# EAGLE design breakout2 (EAGLE 4.15)
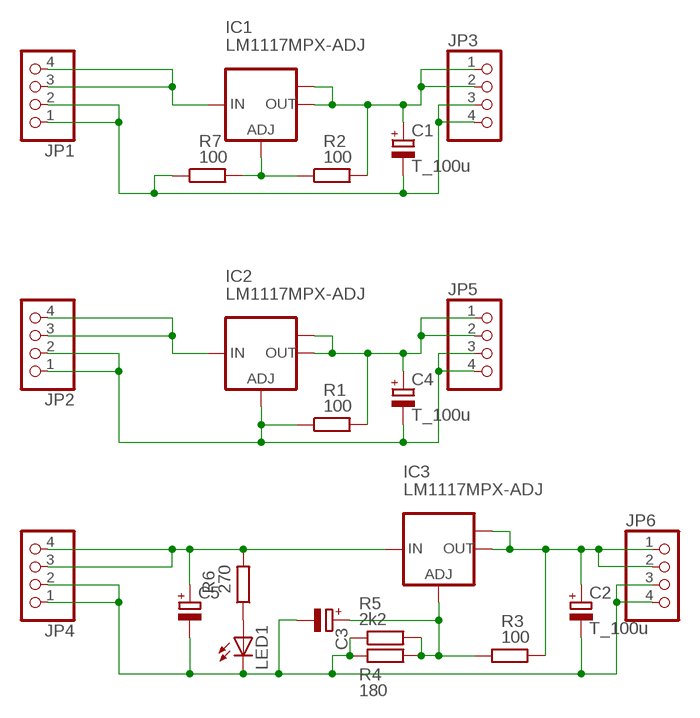
[diagram p0: schematic, sheet 1]

## Parts
C1  T_100u  CPOL-EUSMCC  [SMC_C]
C2  T_100u  CPOL-EUSMCC  [SMC_C]
C3  CPOL-EUB  [PANASONIC_B]
C4  T_100u  CPOL-EUSMCC  [SMC_C]
C5  CPOL-EUD  [PANASONIC_D]
IC1  LM1117MPX-ADJ  [SOT223]
IC2  LM1117MPX-ADJ  [SOT223]
IC3  LM1117MPX-ADJ  [SOT223]
JP1  PINHD-1X4  [1X04]
JP2  PINHD-1X4  [1X04]
JP3  PINHD-1X4  [1X04]
JP4  PINHD-1X4  [1X04]
JP5  PINHD-1X4  [1X04]
JP6  PINHD-1X4  [1X04]
LED1  LEDCHIPLED_0805  [CHIPLED_0805]
R1  100  R-EU_R0805  [R0805]
R2  100  R-EU_R0805  [R0805]
R3  100  R-EU_R0805  [R0805]
R4  180  R-EU_R0805  [R0805]
R5  2k2  R-EU_R0805  [R0805]
R6  270  R-EU_R0805  [R0805]
R7  100  R-EU_R0805  [R0805]

## Nets
FFFUUU: C4.+ IC2.2(OUT) IC2.TAB(OUT1) JP5.1 JP5.2 R1.2
FFFUUU1: C1.+ IC1.2(OUT) IC1.TAB(OUT1) JP3.1 JP3.2 R2.2
FFFUUU2: C2.+ IC3.2(OUT) IC3.TAB(OUT1) JP6.1 JP6.2 R3.2
N$1: C4.- IC2.1(ADJ) JP2.1 JP2.2 JP5.3 JP5.4 R1.1
N$2: IC2.3(IN) JP2.3 JP2.4
N$3: IC1.3(IN) JP1.3 JP1.4
N$4: C1.- JP1.1 JP1.2 JP3.3 JP3.4 R7.1
N$5: C5.+ IC3.3(IN) JP4.3 JP4.4 R6.2
N$6: IC1.1(ADJ) R2.1 R7.2
N$7: C2.- C3.- C5.- JP4.1 JP4.2 JP6.3 JP6.4 LED1.C R4.1 R5.1
N$8: C3.+ IC3.1(ADJ) R3.1 R4.2 R5.2
N$9: LED1.A R6.1

## Library data of the parts
C1-C5 = rcl:CPOL-EU: POLARIZED CAPACITOR, European symbol
IC1-IC3 = lm1117:LM1117MPX-ADJ
JP1-JP6 = pinhead:PINHD-1X4: PIN HEADER
LED1 = led:LED: LED OSRAM: - CHIPLED LG R971, LG N971, LY N971, LG Q971, LY Q971, LO R971, LY R971 LH N974, LH R974 LS Q976, LO Q976, LY Q976 LO Q996 - Hyper CHIPLED LW Q18S LB Q993, LB Q99A, LB R99A - SideLED LS A670, LO A670, LY A670, LG A670, LP A670 LB A673, LV A673, LT A673, LW A673 LH A674 LY A675 LS A676, LA A676, LO A676, LY A676, LW A676 LS A679, LY A679, LG A679 - Hyper Micro SIDELED® LS Y876, LA Y876, LO Y876, LY Y876 LT Y87S - SmartLED LW L88C, LW L88S LB L89C, LB L89S, LG L890 LS L89K, LO L89K, LY L89K LS L896, LA L896, LO L896, LY L896 - TOPLED LS T670, LO T670, LY T670, LG T670, LP T670 LSG T670, LSP T670, LSY T670, LOP T670, LYG T670 LG T671, LOG T671, LSG T671 LB T673, LV T673, LT T673, LW T673 LH T674 LS T676, LA T676, LO T676, LY T676, LB T676, LH T676, LSB T676, LW T676 LB T67C, LV T67C, LT T67C, LS T67K, LO T67K, LY T67K, LW E67C LS E67B, LA E67B, LO E67B, LY E67B, LB E67C, LV E67C, LT E67C LW T67C LS T679, LY T679, LG T679 LS T770, LO T770, LY T770, LG T770, LP T770 LB T773, LV T773, LT T773, LW T773 LH T774 LS E675, LA E675, LY E675, LS T675 LS T776, LA T776, LO T776, LY T776, LB T776 LHGB T686 LT T68C, LB T68C - Hyper Mini TOPLED® LB M676 - Mini TOPLED Santana® LG M470 LS M47K, LO M47K, LY M47K Source: http://www.osram.convergy.de/
R1-R7 = rcl:R-EU_: RESISTOR, European symbol

## Board
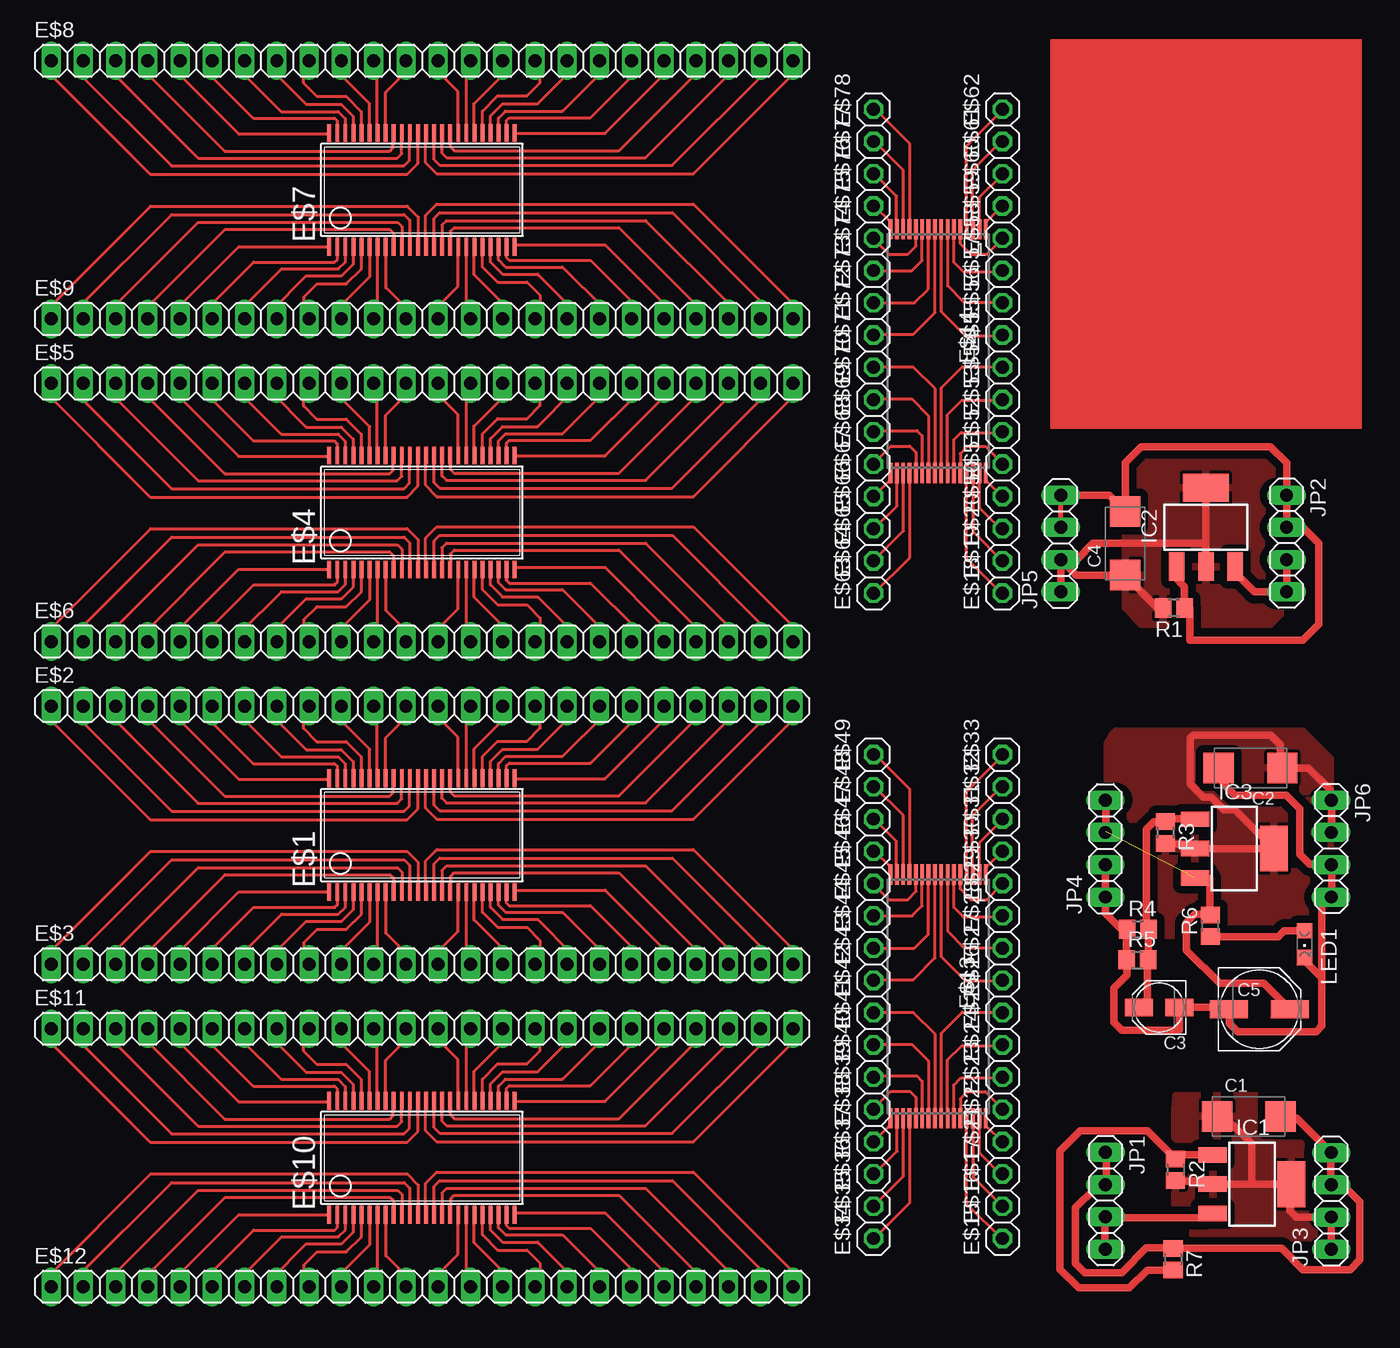
[diagram p1: board, top side]

No outline drawn. Coordinates in mm, seen from the top.
Copper layers (1*16): Top 0.035mm / dielectric 1.5mm / Bottom 0.035mm
Design rules "default": minimum track width 10mil, minimum drill 24mil, track to track 8mil, track to pad 8mil, pad to pad 8mil, via to via 8mil, smd to smd 8mil, copper to edge 40mil, drill to drill 8mil, minimum pad ring 10mil, minimum via ring 8mil, stop-mask expansion 4mil, vias tented up to drill 0mil, thermal gap 10mil

### Footprints (pad centres in the part's own frame; a part is rotated, then mirrored left to right if it is on the bottom)
SMC_C = smd 2.4 x 2.4: + -2.5,0; - 2.5,0
PANASONIC_B = smd 2.2 x 1.4: + 1.6,0; - -1.6,0
PANASONIC_D = smd 3 x 1.4: + 2.4,0; - -2.4,0
SSOP48DL = smd 0.305 x 1.397: 1 -7.303,-4.483; 2 -6.668,-4.483; 3 -6.032,-4.483; 4 -5.397,-4.483; 5 -4.763,-4.483; 6 -4.128,-4.483; 7 -3.493,-4.483; 8 -2.857,-4.483; 9 -2.223,-4.483; 10 -1.587,-4.483; 11 -0.953,-4.483; 12 -0.318,-4.483; 13 0.318,-4.483; 14 0.953,-4.483; 15 1.587,-4.483; 16 2.223,-4.483; 17 2.857,-4.483; 18 3.493,-4.483; 19 4.128,-4.483; 20 4.763,-4.483; 21 5.397,-4.483; 22 6.032,-4.483; 23 6.668,-4.483; 24 7.303,-4.483; 25 7.303,4.483; 26 6.668,4.483; 27 6.032,4.483; 28 5.397,4.483; 29 4.763,4.483; 30 4.128,4.483; 31 3.493,4.483; 32 2.857,4.483; 33 2.223,4.483; 34 1.587,4.483; 35 0.953,4.483; 36 0.318,4.483; 37 -0.318,4.483; 38 -0.953,4.483; 39 -1.587,4.483; 40 -2.223,4.483; 41 -2.857,4.483; 42 -3.493,4.483; 43 -4.128,4.483; 44 -4.763,4.483; 45 -5.397,4.483; 46 -6.032,4.483; 47 -6.668,4.483; 48 -7.303,4.483
1X24 = drill 1.016 long: 1 -29.21,0; 2 -26.67,0; 3 -24.13,0; 4 -21.59,0; 5 -19.05,0; 6 -16.51,0; 7 -13.97,0; 8 -11.43,0; 9 -8.89,0; 10 -6.35,0; 11 -3.81,0; 12 -1.27,0; 13 1.27,0; 14 3.81,0; 15 6.35,0; 16 8.89,0; 17 11.43,0; 18 13.97,0; 19 16.51,0; 20 19.05,0; 21 21.59,0; 22 24.13,0; 23 26.67,0; 24 29.21,0
TSOP32 = smd 0.3 x 1.6: 1 -3.75,-9.6; 2 -3.25,-9.6; 3 -2.75,-9.6; 4 -2.25,-9.6; 5 -1.75,-9.6; 6 -1.25,-9.6; 7 -0.75,-9.6; 8 -0.25,-9.6; 9 0.25,-9.6; 10 0.75,-9.6; 11 1.25,-9.6; 12 1.75,-9.6; 13 2.25,-9.6; 14 2.75,-9.6; 15 3.25,-9.6; 16 3.75,-9.6; 17 3.75,9.59; 18 3.25,9.59; 19 2.75,9.59; 20 2.25,9.59; 21 1.75,9.59; 22 1.25,9.59; 23 0.75,9.59; 24 0.25,9.59; 25 -0.25,9.59; 26 -0.75,9.59; 27 -1.25,9.59; 28 -1.75,9.59; 29 -2.25,9.59; 30 -2.75,9.59; 31 -3.25,9.59; 32 -3.75,9.59
1X01 = drill 1.016 octagon: 1 0,0
SOT223 = smd 1.219 x 2.235: 1 -2.311,-3.099; 2 0,-3.099; 3 2.311,-3.099 | smd 3.6 x 2.2: TAB 0,3.099
1X04 = drill 1.016 long: 1 -3.81,0; 2 -1.27,0; 3 1.27,0; 4 3.81,0
CHIPLED_0805 = smd 1.2 x 1.2: A 0,-1.05; C 0,1.05
R0805 = smd 1.3 x 1.5: 1 -0.85,0; 2 0.85,0

### Placement (x,y rotation side)
C1  98.12,15.96 0 top
C2  98.27,43.39 180 top
C3  91.07,24.53 180 top
C4  88.4,61.06 90 top
C5  98.97,24.39 0 top
E$1  [SSOP48DL]  33.02,38.1 0 top
E$2  [1X24]  33.02,48.26 0 top
E$3  [1X24]  33.02,27.94 0 top
E$4  [SSOP48DL]  33.02,63.5 0 top
E$5  [1X24]  33.02,73.66 0 top
E$6  [1X24]  33.02,53.34 0 top
E$7  [SSOP48DL]  33.02,88.9 0 top
E$8  [1X24]  33.02,99.06 0 top
E$9  [1X24]  33.02,78.74 0 top
E$10  [SSOP48DL]  33.02,12.7 0 top
E$11  [1X24]  33.02,22.86 0 top
E$12  [1X24]  33.02,2.54 0 top
E$13  [TSOP32]  73.66,25.4 180 top
E$14  [TSOP32]  73.66,76.2 180 top
E$15  [1X01]  78.74,6.35 90 top
E$16  [1X01]  78.74,8.89 90 top
E$17  [1X01]  78.74,11.43 90 top
E$18  [1X01]  78.74,57.15 90 top
E$19  [1X01]  78.74,59.69 90 top
E$20  [1X01]  78.74,62.23 90 top
E$21  [1X01]  78.74,13.97 90 top
E$22  [1X01]  78.74,16.51 90 top
E$23  [1X01]  78.74,19.05 90 top
E$24  [1X01]  78.74,21.59 90 top
E$25  [1X01]  78.74,24.13 90 top
E$26  [1X01]  78.74,26.67 90 top
E$27  [1X01]  78.74,29.21 90 top
E$28  [1X01]  78.74,31.75 90 top
E$29  [1X01]  78.74,34.29 90 top
E$30  [1X01]  78.74,36.83 90 top
E$31  [1X01]  78.74,39.37 90 top
E$32  [1X01]  78.74,41.91 90 top
E$33  [1X01]  78.74,44.45 90 top
E$34  [1X01]  68.58,6.35 90 top
E$35  [1X01]  68.58,8.89 90 top
E$36  [1X01]  68.58,11.43 90 top
E$37  [1X01]  68.58,13.97 90 top
E$38  [1X01]  68.58,16.51 90 top
E$39  [1X01]  68.58,19.05 90 top
E$40  [1X01]  68.58,21.59 90 top
E$41  [1X01]  68.58,24.13 90 top
E$42  [1X01]  68.58,26.67 90 top
E$43  [1X01]  68.58,29.21 90 top
E$44  [1X01]  68.58,31.75 90 top
E$45  [1X01]  68.58,34.29 90 top
E$46  [1X01]  68.58,36.83 90 top
E$47  [1X01]  68.58,39.37 90 top
E$48  [1X01]  68.58,41.91 90 top
E$49  [1X01]  68.58,44.45 90 top
E$50  [1X01]  78.74,64.77 90 top
E$51  [1X01]  78.74,67.31 90 top
E$52  [1X01]  78.74,69.85 90 top
E$53  [1X01]  78.74,72.39 90 top
E$54  [1X01]  78.74,74.93 90 top
E$55  [1X01]  78.74,77.47 90 top
E$56  [1X01]  78.74,80.01 90 top
E$57  [1X01]  78.74,82.55 90 top
E$58  [1X01]  78.74,85.09 90 top
E$59  [1X01]  78.74,87.63 90 top
E$60  [1X01]  78.74,90.17 90 top
E$61  [1X01]  78.74,92.71 90 top
E$62  [1X01]  78.74,95.25 90 top
E$63  [1X01]  68.58,57.15 90 top
E$64  [1X01]  68.58,59.69 90 top
E$65  [1X01]  68.58,62.23 90 top
E$66  [1X01]  68.58,64.77 90 top
E$67  [1X01]  68.58,67.31 90 top
E$68  [1X01]  68.58,69.85 90 top
E$69  [1X01]  68.58,72.39 90 top
E$70  [1X01]  68.58,74.93 90 top
E$71  [1X01]  68.58,77.47 90 top
E$72  [1X01]  68.58,80.01 90 top
E$73  [1X01]  68.58,82.55 90 top
E$74  [1X01]  68.58,85.09 90 top
E$75  [1X01]  68.58,87.63 90 top
E$76  [1X01]  68.58,90.17 90 top
E$77  [1X01]  68.58,92.71 90 top
E$78  [1X01]  68.58,95.25 90 top
IC1  98.39,10.62 270 top
IC2  94.75,62.33 0 top
IC3  97,37.04 270 top
JP1  86.85,9.32 270 top
JP2  101.1,61.06 270 top
JP3  104.62,9.31 90 top
JP4  86.84,37.04 90 top
JP5  83.32,61.06 90 top
JP6  104.62,37.04 270 top
LED1  102.51,29.52 180 top
R1  92.21,55.98 180 top
R2  92.36,11.77 270 top
R3  91.55,38.31 270 top
R4  89.38,30.69 0 top
R5  89.35,28.27 0 top
R6  95.09,30.97 90 top
R7  92.17,4.71 270 top

### Tracks (layer width: path | path; a pad name or v marks a point on that pad's centre or on a via)
FFFUUU
  Top 0.61: 94.75,58.52 IC2.2 94.75,61.06 | 94.75,61.06 IC2.TAB | R1.2 90.94,55.98 88.4,58.52 C4.+ 84.55,58.56 JP5.2 | JP5.1 JP5.2 | JP5.2 84.59,59.79 85.86,61.06 94.75,61.06
  pour Top (isolate 0.61): 88.4,68.68 99.83,68.68 101.1,67.41 101.1,55.98 99.83,54.71 89.67,54.71 88.4,55.98
FFFUUU1
  Top 0.61: R2.2 92.37,10.85 95.06,10.85 | 95.06,10.85 IC1.2 95.31,10.6 | JP3.1 104.63,5.49 104.64,5.49 104.64,8.02 JP3.2 104.6,8.01 101.86,8.01 101.34,8.54 101.34,10.48 IC1.TAB 101.47,10.6 98.35,10.6 | 95.06,10.85 95.31,10.6 | 95.31,10.6 98.35,10.6 | 98.35,10.6 98.35,13.81 96.41,15.75 95.64,15.75 95.64,15.94 C1.+
  pour Top (isolate 0.61): 92.37,17.44 92.37,17.57 103.24,17.57 103.24,6.39 92.32,6.39 92.32,16.51
FFFUUU2
  Top 0.61: 104.56,40.79 104.55,40.79 104.55,41.66 102.83,43.38 C2.+ 100.65,43.51 100.61,43.51 100.61,45.23 99.87,45.97 93.76,45.97 93.52,45.73 93.52,42.15 94.56,41.1 95.18,41.1 96.17,40.11 97.03,40.11 100.11,37.03 IC3.TAB | 104.56,40.79 JP6.1 | IC3.TAB | IC3.2 | IC3.2 IC3.TAB | JP6.2 104.68,38.37 104.68,40.68 104.56,40.79 | IC3.2 93.54,37.4 93.53,37.4 91.48,37.4 | 91.26,37.4 91.48,37.4 | 91.48,37.4 R3.2
  pour Top (isolate 0.61): 87.36,45.97 87.68,46.29 102.38,46.29 104.57,44.1 104.57,32.07 102.7,30.2 88.37,30.2 86.99,31.59 86.99,45.33
N$1
  Top 0.406: JP5.3 JP5.4
  Top 0.61: IC2.1 92.44,58.75 92.21,58.52 93.06,57.67 R1.1 93.48,55.98 93.48,53.44 102.37,53.44 103.64,54.71 103.64,61.06 102.37,62.33 JP2.2 | JP5.4 87.13,64.87 88.4,63.6 C4.- 88.4,67.41 89.67,68.68 99.83,68.68 101.1,67.41 | 101.1,67.41 JP2.1 JP2.2 | 101.1,67.41 JP2.2
N$2
  Top 0.61: JP2.3 JP2.4 98.56,57.25 97.06,58.75 IC2.3
N$3
  Top 0.61: IC1.3 94.96,7.98 86.79,7.98 86.79,7.99 JP1.3 86.82,8.01 86.79,8.01 86.79,5.56 JP1.4
N$4
  Top 0.61: 86.92,10.52 86.92,10.51 | 86.92,10.52 JP1.2 86.53,10.27 85.99,10.27 84.48,8.75 84.48,4.41 85.22,3.67 88.15,3.67 90.08,5.6 92.13,5.6 R7.1 | JP1.1 86.92,13.06 86.92,10.52 | C1.- 100.77,15.81 101.93,15.81 JP3.4 104.58,13.07 104.58,10.53 | 104.58,10.53 104.58,10.51 | 104.58,10.53 JP3.3 104.84,10.36 105.78,10.36 106.89,9.25 106.89,4.66 106.14,3.9 102.39,3.9 100.72,5.57 R7.1 | R7.1
N$5  (1 unrouted)
  Top 0.61: C5.+ 99.33,26.44 95.83,26.44 93.23,29.04 93.23,31.22 93.87,31.86 95.08,31.86 R6.2 95.05,31.86 95.05,34.71 93.91,34.71 IC3.3 | JP4.3 86.88,38.35 86.88,40.81 JP4.4
N$6
  Top 0.61: IC1.1 95.28,12.95 92.69,12.95 R2.1 90.16,14.83 85.16,14.83 85.14,14.81 84.85,14.81 83.26,13.22 83.26,3.94 84.74,2.46 88.74,2.46 90.14,3.86 R7.2
N$7
  Top 0.61: 103.9,26.4 103.9,23.08 103.43,22.62 97.26,22.62 96.58,23.3 96.58,24.38 C5.- 96.48,24.49 96.48,24.55 92.68,24.55 C3.- 92.66,24.52 92.66,22.76 92.62,22.73 88.13,22.73 87.48,23.37 87.48,26.04 88.52,27.08 88.52,28.29 88.51,28.29 R5.1 88.48,28.28 88.48,30.72 88.5,30.72 R4.1 88.11,30.69 86.84,31.96 JP4.1 86.83,33.22 | 103.9,26.4 103.9,26.86 102.5,28.25 LED1.C | 103.9,26.4 103.9,32.51 JP6.4 104.67,33.28 104.67,35.82 | 104.67,35.82 104.67,35.91 | 104.67,35.82 JP6.3 104.59,35.8 102.95,35.8 102.15,36.6 102.15,40.18 101.1,41.22 97.03,41.22 96.11,42.15 96.11,43.07 96.08,43.07 C2.- | 86.83,33.22 86.83,32.86 | JP4.2 86.83,35.76 86.83,33.22
N$8
  Top 0.61: C3.+ 90.12,25.19 90.12,28.25 90.18,28.25 R5.2 90.19,28.11 90.21,28.09 90.23,28.11 R4.2 90.17,30.63 90.06,30.63 90.06,38.57 90.64,39.15 91.54,39.15 R3.1 91.6,39.21 91.6,39.41 93.66,39.41 93.75,39.5 IC3.1
N$9
  Top 0.61: R6.1 100.47,30.11 100.94,30.57 LED1.A
S$1
  Top 0.254: 25.7,33.63 18.59,33.63 13.9,28.94
S$2
  Top 0.254: 26.36,33.63 26.36,32.61 26.15,32.41 19.75,32.41 16.21,28.87
S$3
  Top 0.254: 26.99,33.35 26.99,32.44 26.43,31.88 21.95,31.88 18.73,28.66
S$4
  Top 0.254: 27.62,33.24 27.62,32.27 26.68,31.32 23.91,31.32 21.18,28.59 21.11,28.59
S$5
  Top 0.254: 28.25,33.35 28.25,31.88 27.06,30.69 24.75,30.69 23.7,29.64 23.7,28.52
S$6
  Top 0.254: 28.92,33.35 28.92,31.29 26.4,28.77
S$7
  Top 0.254: 29.51,33.38 29.51,28.87 29.58,28.8
S$8
  Top 0.254: 30.18,33.42 30.18,30.38 31.75,28.8
S$9
  Top 0.254: 30.77,33.51 30.77,34.7 30.48,34.99 17.5,34.99 11.28,28.77
S$10
  Top 0.254: 31.44,33.65 31.44,35.19 31.09,35.54 15.4,35.54 8.64,28.78
S$11
  Top 0.254: 32.05,33.7 32.05,35.72 31.61,36.16 13.31,36.16 5.96,28.81
S$12
  Top 0.254: 32.72,33.82 32.72,35.95 31.85,36.83 11.64,36.83 3.45,28.63
S$13
  Top 0.254: 40.33,42.55 47.44,42.55 52.13,47.24
S$14
  Top 0.254: 39.67,42.55 39.67,43.56 39.88,43.77 46.28,43.77 49.82,47.31
S$15
  Top 0.254: 39.04,42.83 39.04,43.74 39.6,44.3 44.08,44.3 47.3,47.52
S$16
  Top 0.254: 38.41,42.94 38.41,43.91 39.35,44.86 42.12,44.86 44.85,47.59 44.92,47.59
S$17
  Top 0.254: 37.78,42.83 37.78,44.3 38.97,45.49 41.28,45.49 42.33,46.54 42.33,47.66
S$18
  Top 0.254: 37.11,42.83 37.11,44.89 39.63,47.41
S$19
  Top 0.254: 36.52,42.8 36.52,47.31 36.45,47.38
S$20
  Top 0.254: 35.85,42.76 35.85,45.8 34.28,47.38
S$21
  Top 0.254: 35.26,42.67 35.26,41.48 35.55,41.19 48.53,41.19 54.75,47.41
S$22
  Top 0.254: 34.59,42.53 34.59,40.99 34.94,40.64 50.62,40.64 57.39,47.4
S$23
  Top 0.254: 33.98,42.47 33.98,40.46 34.41,40.02 52.72,40.02 60.07,47.37
S$24
  Top 0.254: 33.31,42.36 33.31,40.23 34.18,39.35 54.39,39.35 62.58,47.55
S$25
  Top 0.254: 40.34,33.77 47.44,33.77 52.13,29.08
S$26
  Top 0.254: 39.67,33.77 39.67,32.76 39.88,32.55 46.29,32.55 49.82,29.01
S$27
  Top 0.254: 39.04,33.49 39.04,32.58 39.6,32.02 44.08,32.02 47.3,28.8
S$28
  Top 0.254: 38.41,33.39 38.41,32.41 39.36,31.46 42.12,31.46 44.85,28.73 44.92,28.73
S$29
  Top 0.254: 37.78,33.49 37.78,32.02 38.97,30.83 41.28,30.83 42.33,29.78 42.33,28.66
S$30
  Top 0.254: 37.12,33.49 37.12,31.43 39.64,28.91
S$31
  Top 0.254: 36.52,33.53 36.52,29.01 36.45,28.94
S$32
  Top 0.254: 35.86,33.56 35.86,30.52 34.28,28.94
S$33
  Top 0.254: 35.27,33.65 35.27,34.84 35.56,35.13 48.53,35.13 54.75,28.91
S$34
  Top 0.254: 34.6,33.79 34.6,35.34 34.95,35.69 50.63,35.69 57.4,28.92
S$35
  Top 0.254: 33.98,33.85 33.98,35.86 34.42,36.3 52.73,36.3 60.08,28.95
S$36
  Top 0.254: 33.31,33.97 33.31,36.09 34.19,36.97 54.39,36.97 62.59,28.77
S$37
  Top 0.254: 25.68,42.51 18.58,42.51 13.89,47.2
S$38
  Top 0.254: 26.35,42.51 26.35,43.53 26.14,43.74 19.73,43.74 16.2,47.27
S$39
  Top 0.254: 26.98,42.79 26.98,43.7 26.42,44.26 21.94,44.26 18.72,47.48
S$40
  Top 0.254: 27.61,42.9 27.61,43.88 26.66,44.82 23.9,44.82 21.17,47.55 21.1,47.55
S$41
  Top 0.254: 28.24,42.79 28.24,44.26 27.05,45.45 24.74,45.45 23.69,46.5 23.69,47.62
S$42
  Top 0.254: 28.9,42.79 28.9,44.86 26.38,47.38
S$43
  Top 0.254: 29.5,42.76 29.5,47.27 29.57,47.34
S$44
  Top 0.254: 30.16,42.72 30.16,45.77 31.74,47.34
S$45
  Top 0.254: 30.76,42.63 30.76,41.44 30.46,41.15 17.49,41.15 11.27,47.37
S$46
  Top 0.254: 31.43,42.5 31.43,40.95 31.07,40.6 15.39,40.6 8.62,47.37
S$47
  Top 0.254: 32.04,42.44 32.04,40.43 31.6,39.99 13.29,39.99 5.94,47.34
S$48
  Top 0.254: 32.71,42.32 32.71,40.19 31.83,39.32 11.63,39.32 3.43,47.51
S$49
  Top 0.254: 25.7,59.03 18.59,59.03 13.9,54.34
S$50
  Top 0.254: 26.36,59.03 26.36,58.01 26.15,57.8 19.75,57.8 16.21,54.27
S$51
  Top 0.254: 26.99,58.75 26.99,57.84 26.43,57.28 21.95,57.28 18.73,54.06
S$52
  Top 0.254: 27.62,58.65 27.62,57.66 26.68,56.72 23.91,56.72 21.18,53.99 21.11,53.99
S$53
  Top 0.254: 28.25,58.75 28.25,57.28 27.06,56.09 24.75,56.09 23.7,55.04 23.7,53.92
S$54
  Top 0.254: 28.92,58.75 28.92,56.69 26.4,54.16
S$55
  Top 0.254: 29.51,58.78 29.51,54.27 29.58,54.2
S$56
  Top 0.254: 30.18,58.82 30.18,55.77 31.75,54.2
S$57
  Top 0.254: 30.77,58.91 30.77,60.1 30.48,60.39 17.5,60.39 11.28,54.17
S$58
  Top 0.254: 31.44,59.05 31.44,60.59 31.09,60.94 15.4,60.94 8.64,54.18
S$59
  Top 0.254: 32.05,59.1 32.05,61.12 31.61,61.55 13.31,61.55 5.96,54.21
S$60
  Top 0.254: 32.72,59.22 32.72,61.35 31.85,62.23 11.64,62.23 3.45,54.03
S$61
  Top 0.254: 40.33,67.95 47.44,67.95 52.13,72.64
S$62
  Top 0.254: 39.67,67.95 39.67,68.97 39.88,69.17 46.28,69.17 49.82,72.71
S$63
  Top 0.254: 39.04,68.23 39.04,69.14 39.6,69.7 44.08,69.7 47.3,72.92
S$64
  Top 0.254: 38.41,68.33 38.41,69.31 39.35,70.26 42.12,70.26 44.85,72.99 44.92,72.99
S$65
  Top 0.254: 37.78,68.23 37.78,69.7 38.97,70.89 41.28,70.89 42.33,71.94 42.33,73.06
S$66
  Top 0.254: 37.11,68.23 37.11,70.29 39.63,72.81
S$67
  Top 0.254: 36.52,68.19 36.52,72.71 36.45,72.78
S$68
  Top 0.254: 35.85,68.16 35.85,71.2 34.28,72.78
S$69
  Top 0.254: 35.26,68.07 35.26,66.88 35.55,66.59 48.53,66.59 54.75,72.81
S$70
  Top 0.254: 34.59,67.93 34.59,66.39 34.94,66.04 50.62,66.04 57.39,72.8
S$71
  Top 0.254: 33.98,67.87 33.98,65.86 34.41,65.42 52.72,65.42 60.07,72.77
S$72
  Top 0.254: 33.31,67.76 33.31,65.63 34.18,64.75 54.39,64.75 62.58,72.95
S$73
  Top 0.254: 40.34,59.17 47.44,59.17 52.13,54.48
S$74
  Top 0.254: 39.67,59.17 39.67,58.16 39.88,57.95 46.29,57.95 49.82,54.41
S$75
  Top 0.254: 39.04,58.89 39.04,57.98 39.6,57.42 44.08,57.42 47.3,54.2
S$76
  Top 0.254: 38.41,58.79 38.41,57.81 39.36,56.86 42.12,56.86 44.85,54.13 44.92,54.13
S$77
  Top 0.254: 37.78,58.89 37.78,57.42 38.97,56.23 41.28,56.23 42.33,55.18 42.33,54.06
S$78
  Top 0.254: 37.12,58.89 37.12,56.83 39.64,54.31
S$79
  Top 0.254: 36.52,58.93 36.52,54.41 36.45,54.34
S$80
  Top 0.254: 35.86,58.96 35.86,55.92 34.28,54.34
S$81
  Top 0.254: 35.27,59.05 35.27,60.24 35.56,60.53 48.53,60.53 54.75,54.31
S$82
  Top 0.254: 34.6,59.19 34.6,60.74 34.95,61.09 50.63,61.09 57.4,54.32
S$83
  Top 0.254: 33.98,59.25 33.98,61.26 34.42,61.7 52.73,61.7 60.08,54.35
S$84
  Top 0.254: 33.31,59.37 33.31,61.49 34.19,62.37 54.39,62.37 62.59,54.17
S$85
  Top 0.254: 25.68,67.91 18.58,67.91 13.89,72.6
S$86
  Top 0.254: 26.35,67.91 26.35,68.93 26.14,69.14 19.73,69.14 16.2,72.67
S$87
  Top 0.254: 26.98,68.19 26.98,69.1 26.42,69.66 21.94,69.66 18.72,72.88
S$88
  Top 0.254: 27.61,68.3 27.61,69.28 26.66,70.22 23.9,70.22 21.17,72.95 21.1,72.95
S$89
  Top 0.254: 28.24,68.19 28.24,69.66 27.05,70.85 24.74,70.85 23.69,71.9 23.69,73.02
S$90
  Top 0.254: 28.9,68.19 28.9,70.26 26.38,72.78
S$91
  Top 0.254: 29.5,68.16 29.5,72.67 29.57,72.74
S$92
  Top 0.254: 30.16,68.12 30.16,71.17 31.74,72.74
S$93
  Top 0.254: 30.76,68.03 30.76,66.84 30.46,66.55 17.49,66.55 11.27,72.77
S$94
  Top 0.254: 31.43,67.9 31.43,66.35 31.07,66 15.39,66 8.62,72.77
S$95
  Top 0.254: 32.04,67.84 32.04,65.83 31.6,65.39 13.29,65.39 5.94,72.74
S$96
  Top 0.254: 32.71,67.72 32.71,65.59 31.83,64.72 11.63,64.72 3.43,72.91
S$97
  Top 0.254: 25.7,84.43 18.59,84.43 13.9,79.74
S$98
  Top 0.254: 26.36,84.43 26.36,83.42 26.15,83.2 19.75,83.2 16.21,79.67
S$99
  Top 0.254: 26.99,84.15 26.99,83.24 26.43,82.68 21.95,82.68 18.73,79.46
S$100
  Top 0.254: 27.62,84.04 27.62,83.06 26.68,82.12 23.91,82.12 21.18,79.39 21.11,79.39
S$101
  Top 0.254: 28.25,84.15 28.25,82.68 27.06,81.49 24.75,81.49 23.7,80.44 23.7,79.32
S$102
  Top 0.254: 28.92,84.15 28.92,82.08 26.4,79.56
S$103
  Top 0.254: 29.51,84.18 29.51,79.67 29.58,79.6
S$104
  Top 0.254: 30.18,84.22 30.18,81.17 31.75,79.6
S$105
  Top 0.254: 30.77,84.31 30.77,85.5 30.48,85.79 17.5,85.79 11.28,79.57
S$106
  Top 0.254: 31.44,84.45 31.44,85.99 31.09,86.34 15.4,86.34 8.64,79.58
S$107
  Top 0.254: 32.05,84.5 32.05,86.52 31.61,86.95 13.31,86.95 5.96,79.61
S$108
  Top 0.254: 32.72,84.62 32.72,86.75 31.85,87.63 11.64,87.63 3.45,79.43
S$109
  Top 0.254: 40.33,93.35 47.44,93.35 52.13,98.04
S$110
  Top 0.254: 39.67,93.35 39.67,94.36 39.88,94.58 46.28,94.58 49.82,98.11
S$111
  Top 0.254: 39.04,93.63 39.04,94.54 39.6,95.1 44.08,95.1 47.3,98.32
S$112
  Top 0.254: 38.41,93.73 38.41,94.72 39.35,95.66 42.12,95.66 44.85,98.39 44.92,98.39
S$113
  Top 0.254: 37.78,93.63 37.78,95.1 38.97,96.29 41.28,96.29 42.33,97.34 42.33,98.46
S$114
  Top 0.254: 37.11,93.63 37.11,95.69 39.63,98.21
S$115
  Top 0.254: 36.52,93.59 36.52,98.11 36.45,98.18
S$116
  Top 0.254: 35.85,93.56 35.85,96.6 34.28,98.18
S$117
  Top 0.254: 35.26,93.47 35.26,92.28 35.55,91.99 48.53,91.99 54.75,98.21
S$118
  Top 0.254: 34.59,93.33 34.59,91.79 34.94,91.44 50.62,91.44 57.39,98.2
S$119
  Top 0.254: 33.98,93.27 33.98,91.26 34.41,90.82 52.72,90.82 60.07,98.17
S$120
  Top 0.254: 33.31,93.16 33.31,91.03 34.18,90.15 54.39,90.15 62.58,98.35
S$121
  Top 0.254: 40.34,84.57 47.44,84.57 52.13,79.88
S$122
  Top 0.254: 39.67,84.57 39.67,83.56 39.88,83.35 46.29,83.35 49.82,79.81
S$123
  Top 0.254: 39.04,84.29 39.04,83.38 39.6,82.82 44.08,82.82 47.3,79.6
S$124
  Top 0.254: 38.41,84.19 38.41,83.21 39.36,82.26 42.12,82.26 44.85,79.53 44.92,79.53
S$125
  Top 0.254: 37.78,84.29 37.78,82.82 38.97,81.63 41.28,81.63 42.33,80.58 42.33,79.46
S$126
  Top 0.254: 37.12,84.29 37.12,82.23 39.64,79.71
S$127
  Top 0.254: 36.52,84.33 36.52,79.81 36.45,79.74
S$128
  Top 0.254: 35.86,84.36 35.86,81.32 34.28,79.74
S$129
  Top 0.254: 35.27,84.45 35.27,85.64 35.56,85.94 48.53,85.94 54.75,79.71
S$130
  Top 0.254: 34.6,84.59 34.6,86.14 34.95,86.49 50.63,86.49 57.4,79.72
S$131
  Top 0.254: 33.98,84.65 33.98,86.66 34.42,87.1 52.73,87.1 60.08,79.75
S$132
  Top 0.254: 33.31,84.77 33.31,86.89 34.19,87.77 54.39,87.77 62.59,79.58
S$133
  Top 0.254: 25.68,93.31 18.58,93.31 13.89,98
S$134
  Top 0.254: 26.35,93.31 26.35,94.33 26.14,94.54 19.73,94.54 16.2,98.07
S$135
  Top 0.254: 26.98,93.59 26.98,94.5 26.42,95.06 21.94,95.06 18.72,98.28
S$136
  Top 0.254: 27.61,93.7 27.61,94.68 26.66,95.62 23.9,95.62 21.17,98.35 21.1,98.35
S$137
  Top 0.254: 28.24,93.59 28.24,95.06 27.05,96.25 24.74,96.25 23.69,97.3 23.69,98.42
S$138
  Top 0.254: 28.9,93.59 28.9,95.66 26.38,98.18
S$139
  Top 0.254: 29.5,93.56 29.5,98.07 29.57,98.14
S$140
  Top 0.254: 30.16,93.52 30.16,96.57 31.74,98.14
S$141
  Top 0.254: 30.76,93.44 30.76,92.24 30.46,91.95 17.49,91.95 11.27,98.17
S$142
  Top 0.254: 31.43,93.3 31.43,91.75 31.07,91.4 15.39,91.4 8.62,98.17
S$143
  Top 0.254: 32.04,93.24 32.04,91.23 31.6,90.79 13.29,90.79 5.94,98.14
S$144
  Top 0.254: 32.71,93.12 32.71,90.99 31.83,90.12 11.63,90.12 3.43,98.31
S$145
  Top 0.254: 25.7,8.23 18.59,8.23 13.9,3.54
S$146
  Top 0.254: 26.36,8.23 26.36,7.21 26.15,7 19.75,7 16.21,3.47
S$147
  Top 0.254: 26.99,7.95 26.99,7.04 26.43,6.48 21.95,6.48 18.73,3.26
S$148
  Top 0.254: 27.62,7.84 27.62,6.87 26.68,5.92 23.91,5.92 21.18,3.19 21.11,3.19
S$149
  Top 0.254: 28.25,7.95 28.25,6.48 27.06,5.29 24.75,5.29 23.7,4.24 23.7,3.12
S$150
  Top 0.254: 28.92,7.95 28.92,5.88 26.4,3.37
S$151
  Top 0.254: 29.51,7.98 29.51,3.47 29.58,3.4
S$152
  Top 0.254: 30.18,8.02 30.18,4.97 31.75,3.4
S$153
  Top 0.254: 30.77,8.11 30.77,9.3 30.48,9.59 17.5,9.59 11.28,3.37
S$154
  Top 0.254: 31.44,8.25 31.44,9.79 31.09,10.14 15.4,10.14 8.64,3.38
S$155
  Top 0.254: 32.05,8.3 32.05,10.32 31.61,10.76 13.31,10.76 5.96,3.41
S$156
  Top 0.254: 32.72,8.42 32.72,10.55 31.85,11.43 11.64,11.43 3.45,3.23
S$157
  Top 0.254: 40.33,17.15 47.44,17.15 52.13,21.84
S$158
  Top 0.254: 39.67,17.15 39.67,18.16 39.88,18.38 46.28,18.38 49.82,21.91
S$159
  Top 0.254: 39.04,17.43 39.04,18.34 39.6,18.9 44.08,18.9 47.3,22.12
S$160
  Top 0.254: 38.41,17.54 38.41,18.52 39.35,19.46 42.12,19.46 44.85,22.19 44.92,22.19
S$161
  Top 0.254: 37.78,17.43 37.78,18.9 38.97,20.09 41.28,20.09 42.33,21.14 42.33,22.26
S$162
  Top 0.254: 37.11,17.43 37.11,19.49 39.63,22.01
S$163
  Top 0.254: 36.52,17.39 36.52,21.91 36.45,21.98
S$164
  Top 0.254: 35.85,17.36 35.85,20.4 34.28,21.98
S$165
  Top 0.254: 35.26,17.27 35.26,16.08 35.55,15.79 48.53,15.79 54.75,22.01
S$166
  Top 0.254: 34.59,17.13 34.59,15.59 34.94,15.24 50.62,15.24 57.39,22
S$167
  Top 0.254: 33.98,17.07 33.98,15.06 34.41,14.62 52.72,14.62 60.07,21.97
S$168
  Top 0.254: 33.31,16.96 33.31,14.83 34.18,13.95 54.39,13.95 62.58,22.15
S$169
  Top 0.254: 73.44,15.9 73.44,22.43 71.73,24.13 68.69,24.13
S$170
  Top 0.254: 72.89,16.03 72.89,20.33 71.58,21.64 68.59,21.64 68.49,21.54
S$171
  Top 0.254: 72.4,16.12 72.4,18.75 72,19.14 68.74,19.14 68.69,19.09
S$172
  Top 0.254: 71.91,16.05 71.91,17.46 71.44,17.93 69.95,17.93 68.57,16.55
S$173
  Top 0.254: 73.44,66.7 73.44,73.23 71.73,74.93 68.69,74.93
S$174
  Top 0.254: 72.89,66.83 72.89,71.13 71.58,72.44 68.59,72.44 68.49,72.34
S$175
  Top 0.254: 72.4,66.92 72.4,69.55 72,69.94 68.74,69.94 68.69,69.89
S$176
  Top 0.254: 71.91,66.85 71.91,68.26 71.44,68.73 69.95,68.73 68.57,67.34
S$177
  Top 0.254: 69.9,66.65 69.9,66.08 68.69,64.87
S$178
  Top 0.254: 70.42,66.58 70.42,64.01 68.67,62.25
S$179
  Top 0.254: 70.94,66.6 70.94,62.06 68.62,59.73 68.67,59.73
S$180
  Top 0.254: 71.44,66.58 71.44,59.95 68.62,57.14
S$181
  Top 0.254: 40.34,8.37 47.44,8.37 52.13,3.68
S$182
  Top 0.254: 39.67,8.37 39.67,7.36 39.88,7.15 46.29,7.15 49.82,3.61
S$183
  Top 0.254: 39.04,8.09 39.04,7.18 39.6,6.62 44.08,6.62 47.3,3.4
S$184
  Top 0.254: 38.41,7.99 38.41,7.01 39.36,6.06 42.12,6.06 44.85,3.33 44.92,3.33
S$185
  Top 0.254: 37.78,8.09 37.78,6.62 38.97,5.43 41.28,5.43 42.33,4.38 42.33,3.26
S$186
  Top 0.254: 37.12,8.09 37.12,6.03 39.64,3.51
S$187
  Top 0.254: 36.52,8.13 36.52,3.61 36.45,3.54
S$188
  Top 0.254: 35.86,8.16 35.86,5.12 34.28,3.54
S$189
  Top 0.254: 35.27,8.25 35.27,9.44 35.56,9.73 48.53,9.73 54.75,3.51
S$190
  Top 0.254: 34.6,8.39 34.6,9.94 34.95,10.29 50.63,10.29 57.4,3.52
S$191
  Top 0.254: 33.98,8.45 33.98,10.46 34.42,10.9 52.73,10.9 60.08,3.55
S$192
  Top 0.254: 33.31,8.57 33.31,10.69 34.19,11.57 54.39,11.57 62.59,3.38
S$193
  Top 0.254: 69.9,15.85 69.9,15.29 68.69,14.07
S$194
  Top 0.254: 70.42,15.78 70.42,13.21 68.67,11.45
S$195
  Top 0.254: 70.94,15.8 70.94,11.26 68.62,8.93 68.67,8.93
S$196
  Top 0.254: 71.44,15.78 71.44,9.15 68.62,6.34
S$197
  Top 0.254: 73.91,15.8 73.91,22.5 75.56,24.16 78.63,24.16 78.73,24.26
S$198
  Top 0.254: 74.4,15.98 74.4,20.4 75.54,21.54 78.5,21.54 78.68,21.71
S$199
  Top 0.254: 74.9,16.17 74.9,18.42 75.47,18.99 78.7,18.99 78.75,19.04
S$200
  Top 0.254: 75.42,15.98 75.42,17.34 75.98,17.9 77.37,17.9 78.8,16.47
S$201
  Top 0.254: 77.44,15.73 77.44,15.23 78.73,13.95
S$202
  Top 0.254: 76.9,15.73 76.9,13.09 78.6,11.38 78.6,11.35
S$203
  Top 0.254: 76.43,15.78 76.43,11.18 78.78,8.83
S$204
  Top 0.254: 75.91,15.88 75.91,9.08 78.75,6.24
S$205
  Top 0.254: 68.62,26.73 71.71,26.73 73.41,28.43 73.41,35.21
S$206
  Top 0.254: 68.59,29.2 71.81,29.2 72.89,30.29 72.89,35.26 72.92,35.28
S$207
  Top 0.254: 68.59,31.75 71.61,31.75 72.4,32.54 72.4,34.93
S$208
  Top 0.254: 71.93,35.01 71.93,33.67 71.29,33.03 69.8,33.03 68.54,34.29
S$209
  Top 0.254: 71.44,34.98 71.44,41.73 68.64,44.52
S$210
  Top 0.254: 70.92,35.26 70.92,39.66 68.64,41.93
S$211
  Top 0.254: 70.4,35.01 70.4,37.6 68.64,39.36
S$212
  Top 0.254: 69.93,35.56 68.62,36.86
S$213
  Top 0.254: 73.93,34.98 73.93,28.51 75.81,26.63 78.58,26.63 78.63,26.68 78.6,26.68
S$214
  Top 0.254: 74.43,35.01 74.43,30.54 75.71,29.25 78.68,29.25 78.7,29.23
S$215
  Top 0.254: 74.9,35.01 74.9,32.41 75.64,31.67 78.63,31.67 78.68,31.72
S$216
  Top 0.254: 75.42,34.98 75.42,33.87 76.26,33.03 77.49,33.03 78.68,34.22
S$217
  Top 0.254: 77.39,35.13 77.39,35.5 78.8,36.91
S$218
  Top 0.254: 76.92,35.23 76.92,37.51 78.75,39.33
S$219
  Top 0.254: 76.38,35.11 76.38,39.63 78.7,41.95
S$220
  Top 0.254: 75.91,35.35 75.91,41.53 78.8,44.43
S$221
  Top 0.254: 73.91,66.6 73.91,73.3 75.56,74.96 78.63,74.96 78.73,75.06
S$222
  Top 0.254: 74.4,66.78 74.4,71.2 75.54,72.34 78.5,72.34 78.68,72.51
S$223
  Top 0.254: 74.9,66.97 74.9,69.22 75.47,69.79 78.7,69.79 78.75,69.84
S$224
  Top 0.254: 75.42,66.78 75.42,68.14 75.98,68.7 77.37,68.7 78.8,67.27
S$225
  Top 0.254: 77.44,66.53 77.44,66.03 78.73,64.75
S$226
  Top 0.254: 76.9,66.53 76.9,63.88 78.6,62.18 78.6,62.15
S$227
  Top 0.254: 76.43,66.58 76.43,61.98 78.78,59.63
S$228
  Top 0.254: 75.91,66.68 75.91,59.88 78.75,57.04
S$229
  Top 0.254: 68.62,77.53 71.71,77.53 73.41,79.23 73.41,86.01
S$230
  Top 0.254: 68.59,80 71.81,80 72.89,81.09 72.89,86.06 72.92,86.08
S$231
  Top 0.254: 68.59,82.55 71.61,82.55 72.4,83.34 72.4,85.73
S$232
  Top 0.254: 71.93,85.81 71.93,84.47 71.29,83.83 69.8,83.83 68.54,85.09
S$233
  Top 0.254: 71.44,85.78 71.44,92.53 68.64,95.33
S$234
  Top 0.254: 70.92,86.06 70.92,90.45 68.64,92.73
S$235
  Top 0.254: 70.4,85.81 70.4,88.4 68.64,90.16
S$236
  Top 0.254: 69.93,86.36 68.62,87.66
S$237
  Top 0.254: 73.93,85.78 73.93,79.31 75.81,77.43 78.58,77.43 78.63,77.48 78.6,77.48
S$238
  Top 0.254: 74.43,85.81 74.43,81.33 75.71,80.05 78.68,80.05 78.7,80.03
S$239
  Top 0.254: 74.9,85.81 74.9,83.21 75.64,82.47 78.63,82.47 78.68,82.52
S$240
  Top 0.254: 75.42,85.78 75.42,84.67 76.26,83.83 77.49,83.83 78.68,85.02
S$241
  Top 0.254: 25.68,17.11 18.58,17.11 13.89,21.8
S$242
  Top 0.254: 26.35,17.11 26.35,18.13 26.14,18.34 19.73,18.34 16.2,21.87
S$243
  Top 0.254: 26.98,17.39 26.98,18.3 26.42,18.86 21.94,18.86 18.72,22.08
S$244
  Top 0.254: 27.61,17.5 27.61,18.48 26.66,19.42 23.9,19.42 21.17,22.15 21.1,22.15
S$245
  Top 0.254: 28.24,17.39 28.24,18.86 27.05,20.05 24.74,20.05 23.69,21.1 23.69,22.22
S$246
  Top 0.254: 28.9,17.39 28.9,19.46 26.38,21.98
S$247
  Top 0.254: 29.5,17.36 29.5,21.87 29.57,21.94
S$248
  Top 0.254: 30.16,17.32 30.16,20.37 31.74,21.94
S$249
  Top 0.254: 30.76,17.23 30.76,16.04 30.46,15.75 17.49,15.75 11.27,21.97
S$250
  Top 0.254: 31.43,17.1 31.43,15.55 31.07,15.2 15.39,15.2 8.62,21.97
S$251
  Top 0.254: 32.04,17.04 32.04,15.03 31.6,14.59 13.29,14.59 5.94,21.94
S$252
  Top 0.254: 32.71,16.92 32.71,14.79 31.83,13.92 11.63,13.92 3.43,22.11
S$253
  Top 0.254: 77.39,85.93 77.39,86.3 78.8,87.71
S$254
  Top 0.254: 76.92,86.03 76.92,88.31 78.75,90.13
S$255
  Top 0.254: 76.38,85.91 76.38,90.43 78.7,92.75
S$256
  Top 0.254: 75.91,86.16 75.91,92.33 78.8,95.23
(copper drawn outside any net)
  shapes: Top area x1